# EAGLE design ATmega128RFA1-DevBoard-rev2.routed (EAGLE 7.1.0)
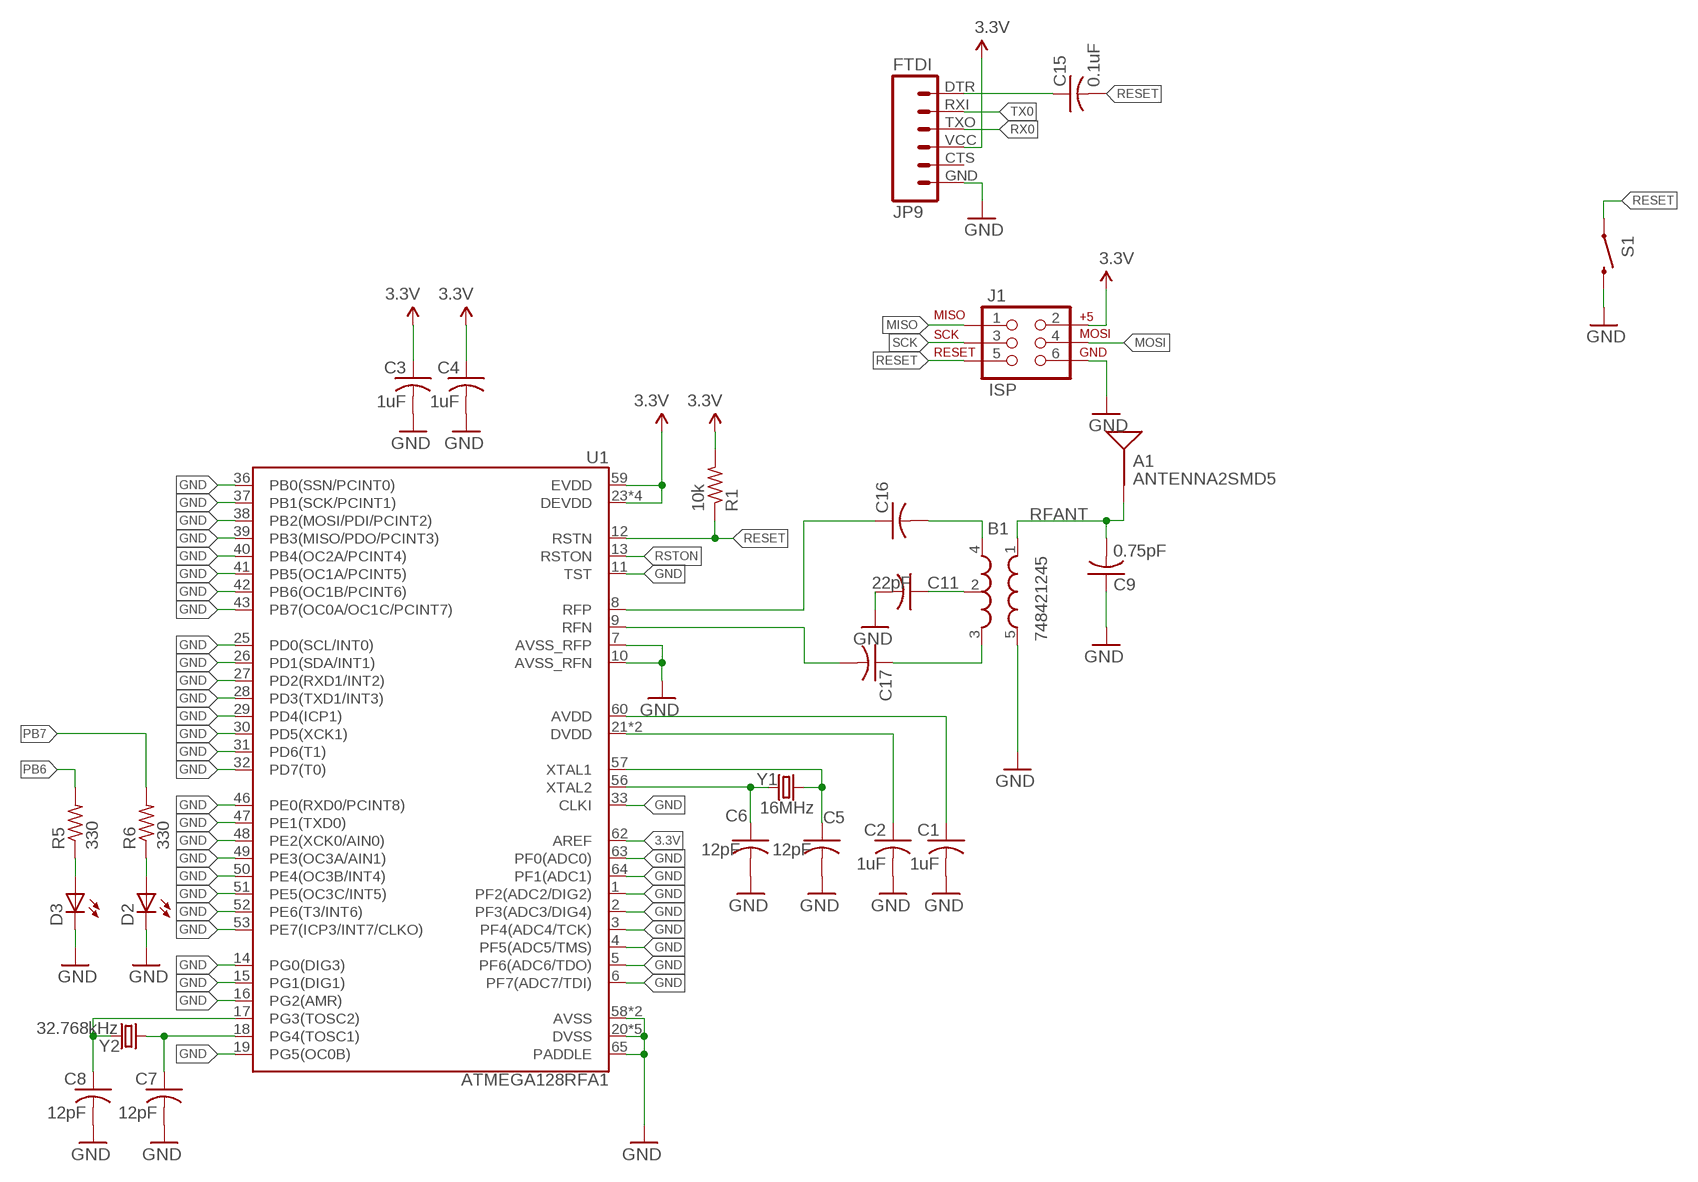
[diagram p0: schematic, sheet 1]

## Parts
A1  ANTENNA2SMD5  [ANTENNA-CHIP5]
B1  748421245  BALUN0805  [BALUN]
C1  1uF  C-USC0805  [C0805]
C2  1uF  C-USC0805  [C0805]
C3  1uF  C-USC0805  [C0805]
C4  1uF  C-USC0805  [C0805]
C5  12pF  C-USC0805  [C0805]
C6  12pF  C-USC0805  [C0805]
C7  12pF  C-USC0805  [C0805]
C8  12pF  C-USC0805  [C0805]
C9  0.75pF  C-USC0805  [C0805]
C11  22pF  C-USC0805  [C0805]
C15  0.1uF  C-USC0805  [C0805]
C16  C-USC0805  [C0805]
C17  C-USC0805  [C0805]
D2  LED5MM  [LED5MM]
D3  LED5MM  [LED5MM]
J1  ISP  AVR_SPI_PRG_6NS  [2X3-NS]
JP9  FTDI  FTDI_BASICPTH  [FTDI_BASIC]
R1  10k  R-US_R0805  [R0805]
R5  330  R-US_R0805  [R0805]
R6  330  R-US_R0805  [R0805]
S1  SWITCH-MOMENTARY-2SMD  [TACTILE_SWITCH_SMD]
U1  ATMEGA128RFA1  [QFN-64]
Y1  16MHz  CRYSTAL5X3  [CRYSTAL-SMD-5X3]
Y2  32.768kHz  CRYSTAL32-SMD  [CRYSTAL-32KHZ-SMD]

## Nets
3.3V: C3.1 C4.1 J1.2 JP9.VCC R1.2 U1.23(DEVDD) U1.34(DEVDD) U1.44(DEVDD) U1.54(DEVDD) U1.59(EVDD) U1.62(AREF)
AVDD: C1.1 U1.60(AVDD)
DTR: C15.1 JP9.DTR
DVDD: C2.1 U1.21(DVDD) U1.22(DVDD)
GND: B1.5(GND) C1.2 C2.2 C3.2 C4.2 C5.2 C6.2 C7.2 C8.2 C9.1 C11.2 D2.K(C) D3.K(C) J1.6 JP9.GND S1.3 U1.1(PF2(ADC2/DIG2)) U1.2(PF3(ADC3/DIG4)) U1.3(PF4(ADC4/TCK)) U1.4(PF5(ADC5/TMS)) U1.5(PF6(ADC6/TDO)) U1.6(PF7(ADC7/TDI)) U1.7(AVSS_RFP) U1.10(AVSS_RFN) U1.11(TST) U1.14(PG0(DIG3)) U1.15(PG1(DIG1)) U1.16(PG2(AMR)) U1.19(PG5(OC0B)) U1.20(DVSS) U1.24(DVSS) U1.25(PD0(SCL/INT0)) U1.26(PD1(SDA/INT1)) U1.27(PD2(RXD1/INT2)) U1.28(PD3(TXD1/INT3)) U1.29(PD4(ICP1)) U1.30(PD5(XCK1)) U1.31(PD6(T1)) U1.32(PD7(T0)) U1.33(CLKI) U1.35(DVSS) U1.36(PB0(SSN/PCINT0)) U1.37(PB1(SCK/PCINT1)) U1.38(PB2(MOSI/PDI/PCINT2)) U1.39(PB3(MISO/PDO/PCINT3)) U1.40(PB4(OC2A/PCINT4)) U1.41(PB5(OC1A/PCINT5)) U1.42(PB6(OC1B/PCINT6)) U1.43(PB7(OC0A/OC1C/PCINT7)) U1.45(DVSS) U1.46(PE0(RXD0/PCINT8)) U1.47(PE1(TXD0)) U1.48(PE2(XCK0/AIN0)) U1.49(PE3(OC3A/AIN1)) U1.50(PE4(OC3B/INT4)) U1.51(PE5(OC3C/INT5)) U1.52(PE6(T3/INT6)) U1.53(PE7(ICP3/INT7/CLKO)) U1.55(DVSS) U1.58(AVSS) U1.61(AVSS) U1.63(PF0(ADC0)) U1.64(PF1(ADC1)) U1.65(PADDLE)
MISO: J1.1
MOSI: J1.4
N$3: C5.1 U1.57(XTAL1) Y1.3
N$4: C6.1 U1.56(XTAL2) Y1.1
N$5: C7.1 U1.18(PG4(TOSC1)) Y2.X1
N$6: C8.1 U1.17(PG3(TOSC2)) Y2.X2
N$7: B1.2(GND) C11.1
N$8: D3.A R5.1
N$10: B1.4(OUT1) C16.2
N$11: B1.3(OUT2) C17.1
N$13: D2.A R6.1
PB6: R5.2
PB7: R6.2
RESET: C15.2 J1.5 R1.1 S1.1 U1.12(RSTN)
RFANT [RFSIG]: A1.FEED(SIGNAL) B1.1(IN) C9.2
RFN: C17.2 U1.9(RFN)
RFP: C16.1 U1.8(RFP)
RSTON: U1.13(RSTON)
RX0: JP9.TXO
SCK: J1.3
TX0: JP9.RXI
Unconnected: JP9.CTS

## Library data of the parts
A1 = SparkFun-RF:ANTENNA2: Chip antenna Single endded antenna. Common with smaller chip antennas. CHIP4 package is the GPS Chip Antenna SKU: GPS-08418. CHIP5 package is 2.4GHz chip antenna SKU: WRL-00144.
B1 = SparkFun-RF:BALUN: 0805 footprint balun- Ember 351/357
C1-C9 C11 C15-C17 = resistor:C-US: CAPACITOR, American symbol
D2 D3 = Components:LED: LED OSRAM: - CHIPLED LG R971, LG N971, LY N971, LG Q971, LY Q971, LO R971, LY R971 LH N974, LH R974 LS Q976, LO Q976, LY Q976 LO Q996 - Hyper CHIPLED LW Q18S LB Q993, LB Q99A, LB R99A - SideLED LS A670, LO A670, LY A670, LG A670, LP A670 LB A673, LV A673, LT A673, LW A673 LH A674 LY A675 LS A676, LA A676, LO A676, LY A676, LW A676 LS A679, LY A679, LG A679 - Hyper Micro SIDELED® LS Y876, LA Y876, LO Y876, LY Y876 LT Y87S - SmartLED LW L88C, LW L88S LB L89C, LB L89S, LG L890 LS L89K, LO L89K, LY L89K LS L896, LA L896, LO L896, LY L896 - TOPLED LS T670, LO T670, LY T670, LG T670, LP T670 LSG T670, LSP T670, LSY T670, LOP T670, LYG T670 LG T671, LOG T671, LSG T671 LB T673, LV T673, LT T673, LW T673 LH T674 LS T676, LA T676, LO T676, LY T676, LB T676, LH T676, LSB T676, LW T676 LB T67C, LV T67C, LT T67C, LS T67K, LO T67K, LY T67K, LW E67C LS E67B, LA E67B, LO E67B, LY E67B, LB E67C, LV E67C, LT E67C LW T67C LS T679, LY T679, LG T679 LS T770, LO T770, LY T770, LG T770, LP T770 LB T773, LV T773, LT T773, LW T773 LH T774 LS E675, LA E675, LY E675, LS T675 LS T776, LA T776, LO T776, LY T776, LB T776 LHGB T686 LT T68C, LB T68C - Hyper Mini TOPLED® LB M676 - Mini TOPLED Santana® LG M470 LS M47K, LO M47K, LY M47K Source: http://www.osram.convergy.de/
J1 = SparkFun-Connectors:AVR_SPI_PRG_6: AVR ISP 6 Pin This is the reduced ISP connector for AVR programming. Common on Arduino. This footprint will take up less PCB space and can be used with a 10-pin to 6-pin adapter such as SKU: BOB-08508
JP9 = SparkFun-Connectors:FTDI_BASIC: FTDI Basic header with labels
R1 R5 R6 = resistor:R-US_: RESISTOR, American symbol
S1 = SparkFun-Electromechanical:SWITCH-MOMENTARY-2: Various NO switches- pushbuttons, reed, etc
U1 = SparkFun-DigitalIC:ATMEGA128RFA1: ATmega128RFA1 8-bit AVR Microcontroller with Low Power 2.4GHz Transceiver for ZigBee and IEEE 802.15.4
Y1 Y2 = SparkFun-FreqCtrl:CRYSTAL: Various standard crystals. Proven footprints. Spark Fun Electronics SKU : COM-00534

## Net classes
1 RFSIG: width 0.457 mm

## Board
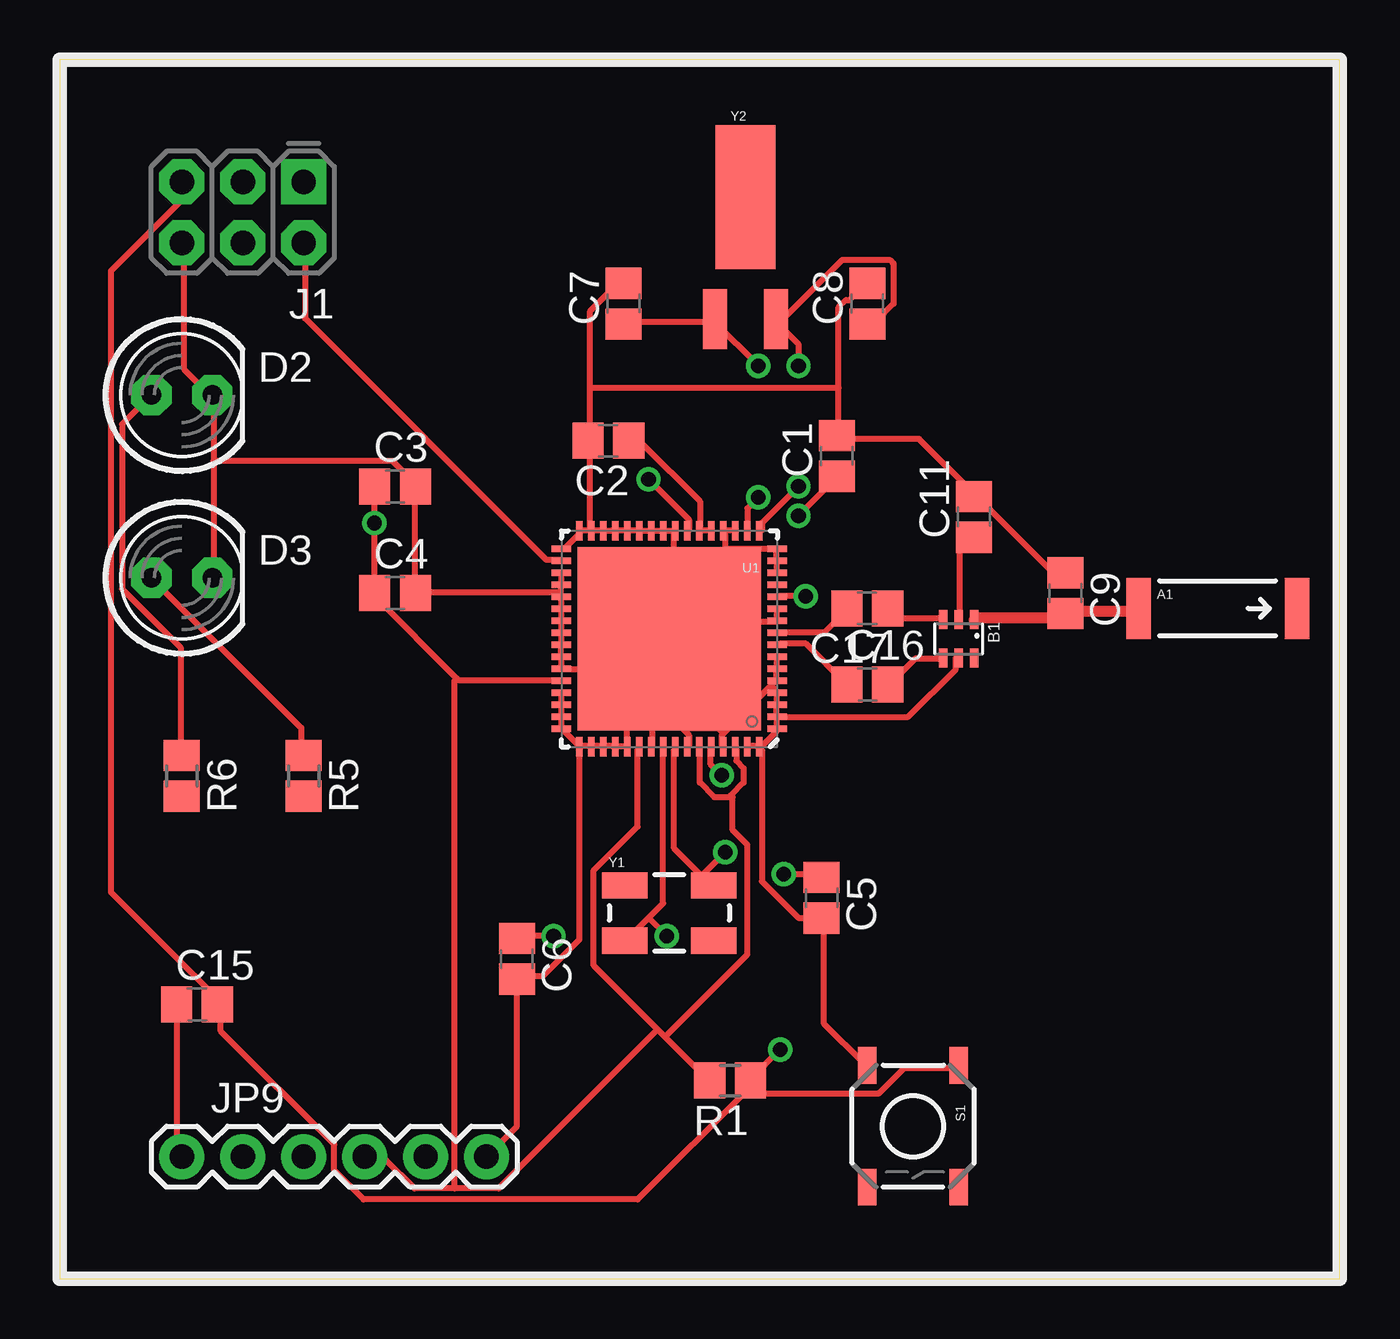
[diagram p1: board, top side]
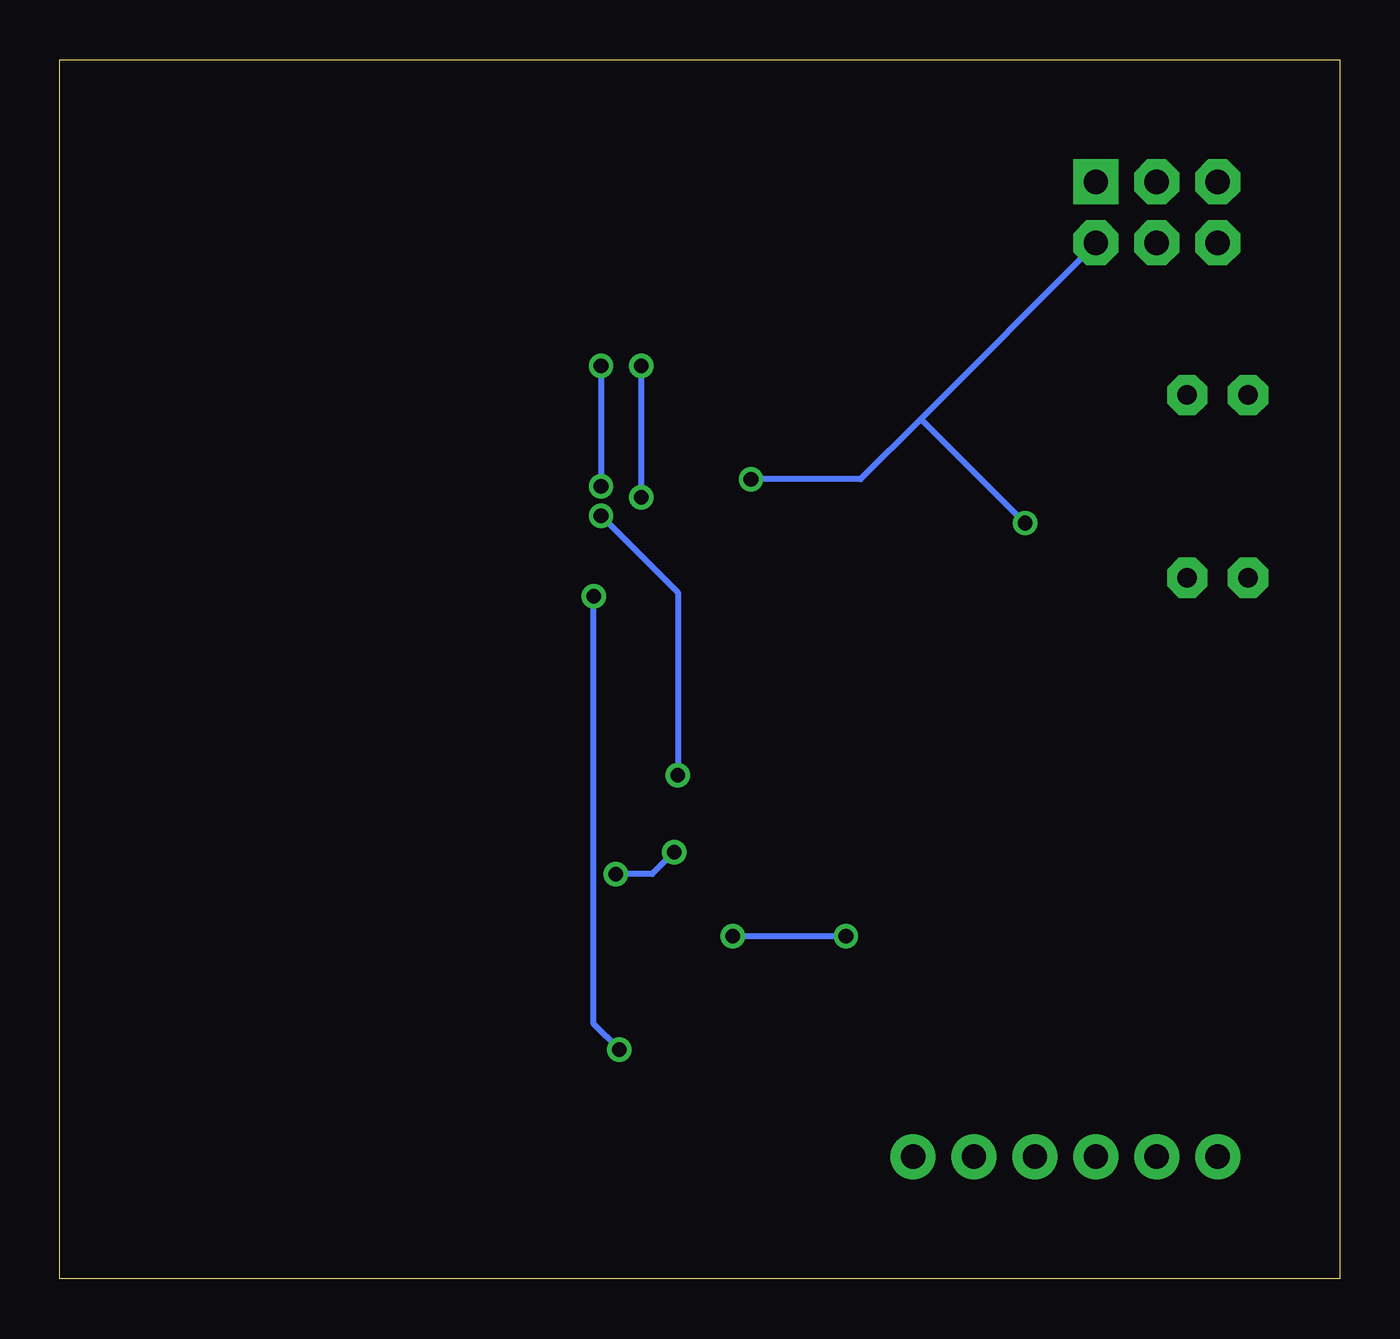
[diagram p2: board, bottom side, seen from below]

Size 53.34 x 50.8 mm. Coordinates in mm from the lower left corner, seen from the top.
Outline: 0,0 53.34,0 53.34,50.8 0,50.8 0,0
Copper layers (1*16): Top 0.035mm / dielectric 1.5mm / Bottom 0.035mm
Design rules "default *": minimum track width 10mil, minimum drill 24mil, track to track 6mil, track to pad 6mil, pad to pad 6mil, via to via 8mil, smd to smd 6mil, copper to edge 40mil, drill to drill 6mil, minimum pad ring 10mil, minimum via ring 8mil, stop-mask expansion 4mil, vias tented up to drill 0mil, thermal gap 10mil

### Footprints (pad centres in the part's own frame; a part is rotated, then mirrored left to right if it is on the bottom)
ANTENNA-CHIP5 = smd 1.016 x 2.54: FEED -3.302,0; NC 3.302,0
BALUN = smd 0.35 x 0.8: 1 -0.65,-0.8; 2 0,-0.8; 3 0.65,-0.8; 4 0.65,0.8; 5 0,0.8; 6 -0.65,0.8
C0805 = smd 1.3 x 1.5: 1 -0.85,0; 2 0.85,0
LED5MM = drill 0.813 pad 1.676 octagon: A -1.27,0; K 1.27,0
2X3-NS = drill 1.016 pad 1.88 square: 1 -2.54,-1.27 | drill 1.016 pad 1.88 octagon: 2 -2.54,1.27; 3 0,-1.27; 4 0,1.27; 5 2.54,-1.27; 6 2.54,1.27
FTDI_BASIC = drill 1.016 pad 1.88: CTS 10.16,0; DTR 0,0; GND 12.7,0; RXI 2.54,0; TXO 5.08,0; VCC 7.62,0
R0805 = smd 1.3 x 1.5: 1 -0.85,0; 2 0.85,0
TACTILE_SWITCH_SMD = smd 1.524 x 0.762: 1 -2.54,1.905; 2 2.54,1.905; 3 -2.54,-1.905; 4 2.54,-1.905
QFN-64 = smd 0.8 x 0.28: 1 -4.5,3.75; 2 -4.5,3.25; 3 -4.5,2.75; 4 -4.5,2.25; 5 -4.5,1.75; 6 -4.5,1.25; 7 -4.5,0.75; 8 -4.5,0.25; 9 -4.5,-0.25; 10 -4.5,-0.75; 11 -4.5,-1.25; 12 -4.5,-1.75; 13 -4.5,-2.25; 14 -4.5,-2.75; 15 -4.5,-3.25; 16 -4.5,-3.75; 33 4.5,-3.75; 34 4.5,-3.25; 35 4.5,-2.75; 36 4.5,-2.25; 37 4.5,-1.75; 38 4.5,-1.25; 39 4.5,-0.75; 40 4.5,-0.25; 41 4.5,0.25; 42 4.5,0.75; 43 4.5,1.25; 44 4.5,1.75; 45 4.5,2.25; 46 4.5,2.75; 47 4.5,3.25; 48 4.5,3.75 | smd 0.28 x 0.8: 17 -3.75,-4.5; 18 -3.25,-4.5; 19 -2.75,-4.5; 20 -2.25,-4.5; 21 -1.75,-4.5; 22 -1.25,-4.5; 23 -0.75,-4.5; 24 -0.25,-4.5; 25 0.25,-4.5; 26 0.75,-4.5; 27 1.25,-4.5; 28 1.75,-4.5; 29 2.25,-4.5; 30 2.75,-4.5; 31 3.25,-4.5; 32 3.75,-4.5; 49 3.75,4.5; 50 3.25,4.5; 51 2.75,4.5; 52 2.25,4.5; 53 1.75,4.5; 54 1.25,4.5; 55 0.75,4.5; 56 0.25,4.5; 57 -0.25,4.5; 58 -0.75,4.5; 59 -1.25,4.5; 60 -1.75,4.5; 61 -2.25,4.5; 62 -2.75,4.5; 63 -3.25,4.5; 64 -3.75,4.5 | smd 7.65 x 7.65: 65 0,0
CRYSTAL-SMD-5X3 = smd 1.9 x 1.1: 1 -1.85,-1.15; 2 1.85,-1.15; 3 1.85,1.15; 4 -1.85,1.15
CRYSTAL-32KHZ-SMD = smd 2.5 x 6: SHEILD 0,5.08 | smd 1 x 2.5: X1 -1.27,0; X2 1.27,0

### Placement (x,y rotation side)
A1  48.26,27.94 0 top
B1  37.47,26.67 180 top
C1  32.38,34.29 90 top
C2  22.86,34.92 180 top
C3  13.97,33.02 0 top
C4  13.97,28.57 0 top
C5  31.75,15.88 270 top
C6  19.05,13.34 270 top
C7  23.5,40.64 90 top
C8  33.66,40.64 90 top
C9  41.91,28.57 270 top
C11  38.1,31.75 90 top
C15  5.71,11.43 0 top
C16  33.66,24.77 0 top
C17  33.66,27.94 180 top
D2  5.08,36.83 0 top
D3  5.08,29.21 0 top
J1  7.62,44.45 180 top
JP9  5.08,5.08 0 top
R1  27.94,8.25 180 top
R5  10.16,20.95 270 top
R6  5.08,20.95 270 top
S1  35.56,6.35 270 top
U1  25.4,26.67 180 top
Y1  25.4,15.24 0 top
Y2  28.57,40.01 0 top

### Tracks (layer width: path | path; a pad name or v marks a point on that pad's centre or on a via)
3.3V  (via drill 0.61)
  Top 0.254: U1.34 20.88,29.97 20.27,29.97 10.21,40.03 10.21,43.08 J1.2 | v24.54,33.33 26.21,31.65 26.21,31.19 U1.23 | 16.54,25.02 13.11,28.45 C4.1 13.11,28.6 v13.11,31.5 13.11,33.02 C3.1 | 16.54,25.02 16.61,24.94 20.88,24.94 U1.44 | 27.96,20.14 28.5,20.68 28.5,21.29 28.19,21.59 28.19,22.05 U1.62 | 27.96,20.14 27.89,20.07 27.28,20.07 26.67,20.68 26.67,22.05 U1.59 | 25.22,10.08 26.98,8.33 R1.2 | 25.22,10.08 24.92,10.39 | 24.92,10.39 22.25,13.06 22.25,17.02 24.08,18.85 24.08,22.05 U1.54 | 25.22,10.08 28.65,13.51 28.65,18.09 28.04,18.69 28.04,20.07 27.96,20.14 | 16.46,3.76 18.29,3.76 24.92,10.39 | 16.46,3.76 14.78,3.76 13.56,4.98 12.8,4.98 JP9.VCC | 16.46,3.76 16.46,24.94 16.54,25.02
  Bottom 0.254: v24.54,33.33 19.96,33.33 17.45,35.84 | 17.45,35.84 10.21,43.08 J1.2 | v13.11,31.5 17.45,35.84
AVDD  (via drill 0.61)
  Top 0.254: v27.58,20.98 27.13,21.44 27.13,22.05 U1.60 | v30.79,31.8 32.31,33.33 C1.1
  Bottom 0.254: v27.58,20.98 27.58,28.6 v30.79,31.8
DTR
  Top 0.254: JP9.DTR 4.88,5.28 4.88,11.38 C15.1
DVDD
  Top 0.254: 26.67,31.19 27.13,31.19 U1.21 | 26.67,31.19 26.67,32.41 24.23,34.85 23.77,34.85 C2.1 | 26.67,31.19 U1.22
GND
  Top 0.254: S1.3 33.53,8.94 31.85,10.62 31.85,14.88 C5.2 31.7,15.04 30.79,15.04 29.26,16.56 29.26,22.05 U1.64 | U1.7 29.87,25.86 29.87,25.55 U1.6 29.87,25.4 29.87,24.94 | 29.87,24.94 29.64,24.71 | 29.64,24.71 27.66,22.73 | 27.66,22.73 27.58,22.66 27.58,22.2 U1.61 | 29.64,24.71 29.87,24.49 U1.4 29.87,24.33 29.87,24.03 U1.3 29.87,23.88 29.87,23.42 | 29.87,24.94 U1.5 | U1.63 28.65,22.2 29.11,22.2 U1.64 | 29.87,23.42 29.87,22.96 U1.1 29.87,22.81 29.26,22.2 U1.64 | B1.5 37.34,25.86 37.34,25.4 35.36,23.42 30.02,23.42 U1.2 29.87,23.42 | 38.1,32.72 41.3,29.52 41.91,29.52 C9.1 | 38.1,32.72 35.81,35 32.46,35 C1.2 32.46,35.15 32.46,37.13 | 38.1,32.72 C11.2 | 32.46,37.13 32.46,40.49 32.77,40.79 32.92,40.79 33.53,41.4 C8.2 | 6.4,34.09 6.4,36.83 D2.K 6.25,36.83 5.18,37.9 5.18,43.08 J1.6 | 6.4,34.09 6.4,29.21 D3.K | U1.33 21.03,30.43 21.64,31.04 U1.32 21.64,31.19 22.1,31.19 | 25.15,31.19 24.69,31.19 U1.26 24.54,31.19 24.23,31.19 U1.27 24.08,31.19 23.77,31.19 U1.28 23.62,31.19 23.16,31.19 U1.29 23.01,31.19 22.71,31.19 U1.30 22.55,31.19 22.25,31.19 U1.31 22.1,31.19 | 25.15,31.19 25.6,31.19 U1.24 25.6,31.04 25.6,27.23 U1.65 | 25.15,31.19 U1.25 | 22.1,31.19 22.1,34.85 C2.2 22.1,35 22.1,37.13 | 22.1,37.13 22.1,40.34 23.16,41.4 23.47,41.4 C7.2 | JP9.GND 19.05,6.35 C6.2 19.05,12.6 20.12,12.6 21.64,14.12 21.64,22.05 U1.49 21.64,22.2 | 20.88,23.42 20.88,22.96 U1.48 21.03,22.81 21.64,22.2 | U1.45 20.88,24.33 20.88,24.03 U1.46 20.88,23.88 20.88,23.42 | 20.88,23.42 U1.47 | 21.64,22.2 22.1,22.2 U1.50 22.25,22.2 22.55,22.2 U1.51 22.71,22.2 23.01,22.2 U1.52 23.16,22.2 23.62,22.2 | U1.35 20.88,29.36 20.88,29.06 U1.36 20.88,28.9 20.88,28.6
  Top 0.254: 20.88,26.92 20.88,27.38 U1.39 20.88,27.53 20.88,27.84 U1.38 20.88,27.99 20.88,28.3 U1.37 20.88,28.45 20.88,28.6 | 20.88,26.92 20.88,26.47 U1.41 20.88,26.31 20.88,26.01 U1.42 20.88,25.86 20.88,25.55 U1.43 21.03,25.4 23.62,25.4 | 20.88,26.92 U1.40 | U1.14 29.87,29.52 29.87,29.82 U1.15 29.87,29.97 29.87,30.43 | U1.19 28.04,31.19 27.74,31.19 U1.20 27.74,31.04 27.74,30.43 | U1.11 29.87,27.84 29.87,27.53 U1.10 29.87,27.38 27.74,27.38 | 24.69,25.4 24.69,26.01 25.3,26.62 U1.65 | 24.69,25.4 24.69,24.18 | 24.69,24.18 24.69,22.2 U1.55 | 24.69,24.18 26.21,22.66 26.21,22.2 U1.58 | 24.69,24.18 U1.65 | 27.74,27.38 26.06,27.38 25.45,26.77 U1.65 | 27.74,27.38 27.74,30.43 | 27.74,27.38 U1.65 | 27.74,30.43 29.87,30.43 | 29.87,30.43 U1.16 | 27.74,30.43 U1.65 | 24.69,25.4 23.62,25.4 | 24.69,25.4 U1.65 | 23.62,25.4 23.62,22.2 | 23.62,22.2 U1.53 | 23.62,25.4 U1.65 | 20.88,28.6 14.94,28.6 C4.2 14.78,28.6 14.78,33.02 C3.2 14.94,33.02 13.87,34.09 6.4,34.09 | 22.1,37.13 32.46,37.13 | 27.66,22.73 27.43,22.96 26.06,22.96 U1.65
N$3  (via drill 0.61)
  Top 0.254: U1.57 25.6,22.05 25.6,17.93 27.13,16.41 Y1.3 26.82,16.87 v27.74,17.78 | v30.18,16.87 31.7,16.87 C5.1
  Bottom 0.254: v30.18,16.87 28.65,16.87 v27.74,17.78
N$4  (via drill 0.61)
  Top 0.254: 24.54,15.04 23.62,14.12 Y1.1 | 24.54,15.04 25.15,15.65 25.15,22.05 U1.56 | v20.57,14.27 19.05,14.27 C6.1 | 24.54,15.04 v25.3,14.27
  Bottom 0.254: v25.3,14.27 v20.57,14.27
N$5  (via drill 0.61)
  Top 0.254: v29.11,32.56 28.65,32.11 28.65,31.19 U1.18 | 27.28,39.88 v29.11,38.05 | 27.28,39.88 23.62,39.88 C7.1 | 27.28,39.88 Y2.X1
  Bottom 0.254: v29.11,38.05 v29.11,32.56
N$6  (via drill 0.61)
  Top 0.254: v30.79,33.02 29.26,31.5 29.26,31.19 U1.17 | v30.79,38.05 30.79,38.96 29.87,39.88 Y2.X2 30.02,39.88 32.61,42.47 34.59,42.47 34.75,42.32 34.75,40.64 33.98,39.88 33.68,39.88 C8.1
  Bottom 0.254: v30.79,38.05 v30.79,33.02
N$7
  Top 0.254: B1.2 37.49,27.53 37.49,30.28 38.1,30.89 C11.1
N$8
  Top 0.254: D3.A 10.06,22.96 10.06,21.89 R5.1
N$10
  Top 0.254: B1.4 36.73,25.86 35.66,25.86 34.59,24.79 C16.2
N$11
  Top 0.254: B1.3 36.73,27.53 34.9,27.53 34.59,27.84 C17.1
N$13
  Top 0.254: D2.A 2.59,35.61 2.59,28.75 5.03,26.31 5.03,21.89 R6.1
RESET  (via drill 0.61)
  Top 0.254: v31.09,28.45 30.02,28.45 U1.12 | v30.02,9.55 28.8,8.33 R1.1 | R1.1 28.65,8.18 28.65,7.87 24.08,3.3 12.65,3.3 11.43,4.52 11.43,5.59 6.71,10.31 6.71,11.38 C15.2 6.71,11.53 2.13,16.1 2.13,42.01 5.03,44.91 5.03,45.67 J1.5 | S1.1 37.34,8.79 35.2,8.79 34.14,7.72 28.65,7.72 R1.1
  Bottom 0.254: v31.09,28.45 31.09,10.62 v30.02,9.55
RFANT
  Top 0.457: B1.1 38.25,27.53 41.76,27.53 41.91,27.69 C9.2 42.06,27.84 44.96,27.84 A1.FEED
RFN
  Top 0.254: U1.9 30.02,26.92 31.85,26.92 32.77,27.84 C17.2
RFP
  Top 0.254: U1.8 30.02,26.47 31.09,26.47 32.77,24.79 C16.1